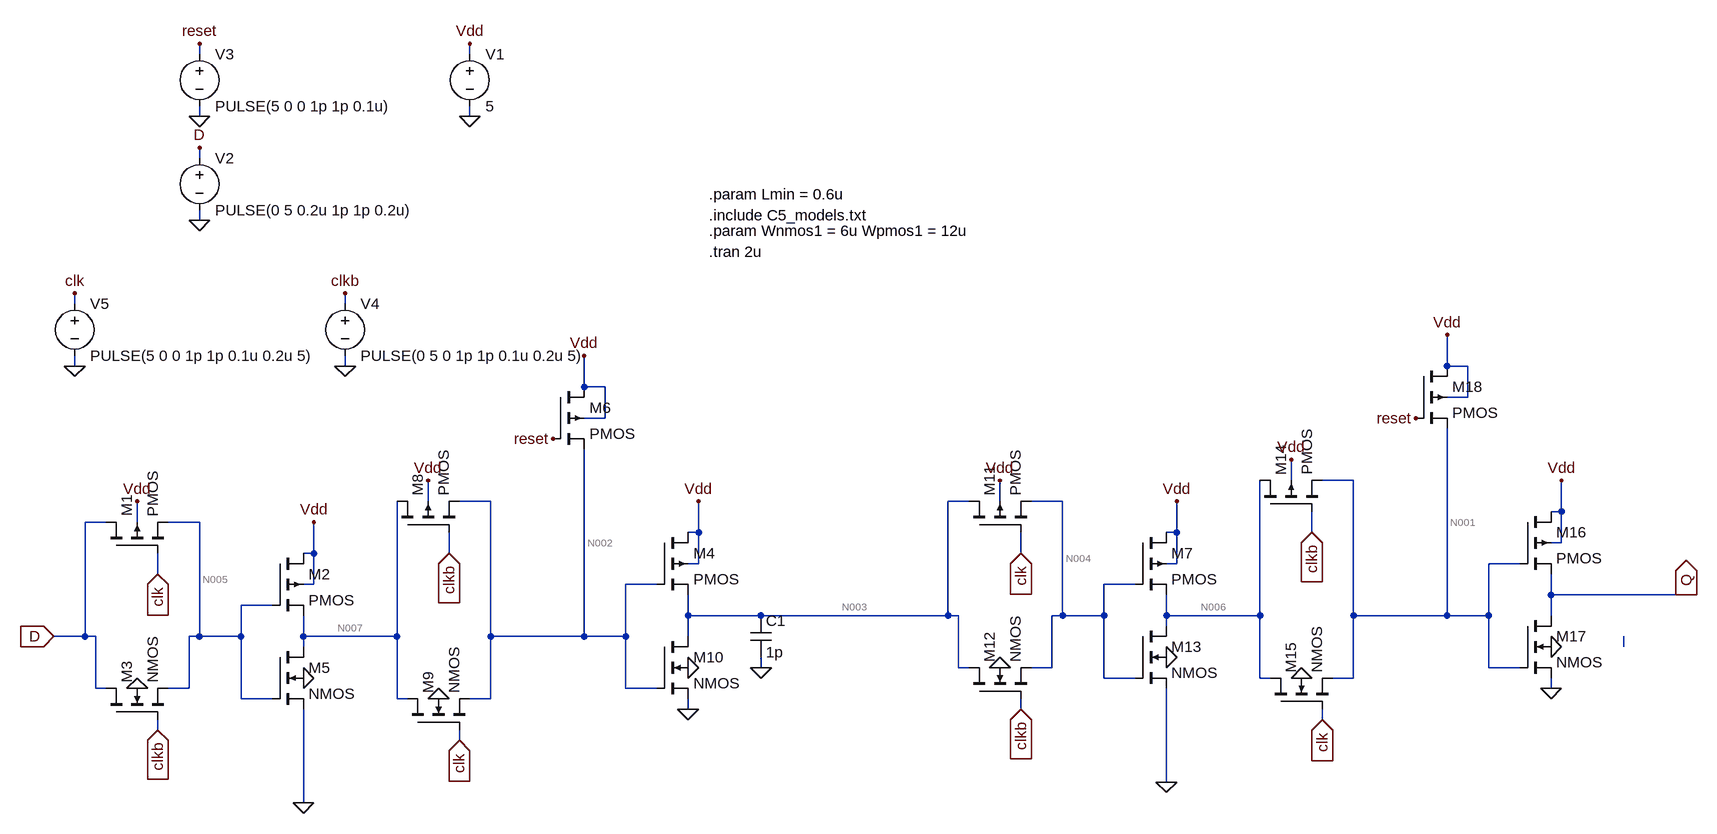
[diagram p0: schematic shiftx.asc]
shiftx.asc, the LTspice schematic file:
Version 4
SHEET 1 1732 852
WIRE -624 -512 -624 -528
WIRE -208 -512 -208 -528
WIRE -624 -416 -624 -432
WIRE -208 -416 -208 -432
WIRE -624 -352 -624 -368
WIRE -624 -256 -624 -272
WIRE -816 -128 -816 -144
WIRE -400 -128 -400 -144
WIRE -816 -32 -816 -48
WIRE -400 -32 -400 -48
WIRE 1296 -32 1296 -80
WIRE 1328 -32 1296 -32
WIRE -32 0 -32 -48
WIRE 0 0 -32 0
WIRE 1328 16 1328 -32
WIRE 1328 16 1296 16
WIRE 0 48 0 0
WIRE 0 48 -32 48
WIRE 1056 144 1056 112
WIRE 1152 144 1104 144
WIRE -272 176 -272 144
WIRE -176 176 -224 176
WIRE 560 176 528 176
WIRE 608 176 608 144
WIRE 704 176 656 176
WIRE 1472 192 1472 144
WIRE 1472 192 1456 192
WIRE -768 208 -800 208
WIRE -720 208 -720 176
WIRE -624 208 -672 208
WIRE 144 224 144 176
WIRE 144 224 128 224
WIRE 880 224 880 176
WIRE 880 224 864 224
WIRE 1088 224 1088 192
WIRE 1472 240 1472 192
WIRE 1472 240 1456 240
WIRE -448 256 -448 208
WIRE -448 256 -464 256
WIRE -240 256 -240 224
WIRE 640 256 640 224
WIRE 144 272 144 224
WIRE 144 272 128 272
WIRE 880 272 880 224
WIRE 880 272 864 272
WIRE 1408 272 1360 272
WIRE -688 288 -688 256
WIRE -448 304 -448 256
WIRE -448 304 -464 304
WIRE 80 304 32 304
WIRE 816 304 768 304
WIRE 1456 320 1456 288
WIRE 1664 320 1456 320
WIRE 1680 320 1664 320
WIRE -512 336 -560 336
WIRE 128 352 128 320
WIRE 240 352 128 352
WIRE 528 352 528 176
WIRE 528 352 240 352
WIRE 544 352 528 352
WIRE 704 352 704 176
WIRE 704 352 688 352
WIRE 768 352 768 304
WIRE 768 352 704 352
WIRE 864 352 864 320
WIRE 1008 352 1008 144
WIRE 1008 352 864 352
WIRE 1152 352 1152 144
WIRE 1296 352 1296 64
WIRE 1296 352 1152 352
WIRE 1360 352 1360 272
WIRE 1360 352 1296 352
WIRE 1456 352 1456 320
WIRE 864 368 864 352
WIRE -800 384 -800 208
WIRE -800 384 -848 384
WIRE -784 384 -800 384
WIRE -624 384 -624 208
WIRE -624 384 -640 384
WIRE -560 384 -560 336
WIRE -560 384 -624 384
WIRE -464 384 -464 352
WIRE -320 384 -320 176
WIRE -320 384 -464 384
WIRE -176 384 -176 176
WIRE -32 384 -32 96
WIRE -32 384 -176 384
WIRE 32 384 32 304
WIRE 32 384 -32 384
WIRE 128 384 128 352
WIRE -464 400 -464 384
WIRE 1568 400 1568 384
WIRE 240 432 240 416
WIRE 544 432 544 352
WIRE 560 432 544 432
WIRE 688 432 688 352
WIRE 688 432 656 432
WIRE 1360 432 1360 352
WIRE 1408 432 1360 432
WIRE 768 448 768 352
WIRE 816 448 768 448
WIRE 1008 448 1008 352
WIRE 1024 448 1008 448
WIRE 1152 448 1152 352
WIRE 1152 448 1120 448
WIRE -784 464 -784 384
WIRE -768 464 -784 464
WIRE -640 464 -640 384
WIRE -640 464 -672 464
WIRE 32 464 32 384
WIRE 80 464 32 464
WIRE 1456 464 1456 448
WIRE -560 480 -560 384
WIRE -512 480 -560 480
WIRE -320 480 -320 384
WIRE -304 480 -320 480
WIRE -176 480 -176 384
WIRE -176 480 -208 480
WIRE 128 496 128 480
WIRE 640 496 640 480
WIRE 1104 512 1104 496
WIRE -688 528 -688 512
WIRE -224 544 -224 528
WIRE 864 608 864 464
WIRE -464 640 -464 496
FLAG -448 208 Vdd
FLAG -208 -416 0
FLAG -208 -528 Vdd
FLAG -720 464 0
FLAG -720 176 Vdd
FLAG -848 384 D
IOPIN -848 384 In
FLAG -688 288 clk
IOPIN -688 288 In
FLAG -688 528 clkb
IOPIN -688 528 In
FLAG -464 448 0
FLAG -464 640 0
FLAG -256 480 0
FLAG -272 144 Vdd
FLAG -240 256 clkb
IOPIN -240 256 In
FLAG -224 544 clk
IOPIN -224 544 In
FLAG 144 176 Vdd
FLAG 128 432 0
FLAG 128 496 0
FLAG -32 -48 Vdd
FLAG -624 -256 0
FLAG -624 -368 D
FLAG -624 -416 0
FLAG -624 -528 reset
FLAG -80 80 reset
FLAG -400 -32 0
FLAG -400 -144 clkb
FLAG -816 -32 0
FLAG -816 -144 clk
FLAG 240 432 0
FLAG 880 176 Vdd
FLAG 608 432 0
FLAG 608 144 Vdd
FLAG 640 256 clk
IOPIN 640 256 In
FLAG 640 496 clkb
IOPIN 640 496 In
FLAG 864 416 0
FLAG 864 608 0
FLAG 1072 448 0
FLAG 1056 112 Vdd
FLAG 1088 224 clkb
IOPIN 1088 224 In
FLAG 1104 512 clk
IOPIN 1104 512 In
FLAG 1472 144 Vdd
FLAG 1456 400 0
FLAG 1456 464 0
FLAG 1664 320 Q
IOPIN 1664 320 Out
FLAG 1296 -80 Vdd
FLAG 1248 48 reset
SYMBOL pmos4 -512 256 R0
SYMATTR InstName M2
SYMATTR Value2 l='Lmin' w='Wpmos1' ad='Lmin*Wpmos1' as='Lmin*Wpmos1' pd='2*(Lmin+Wpmos1)' ps='2*(Lmin+Wpmos1)' m=1
SYMBOL pmos4 -768 256 R270
SYMATTR InstName M1
SYMATTR Value2 l='Lmin' w=12u ad='Lmin*Wpmos1' as='Lmin*Wpmos1' pd='2*(Lmin+Wpmos1)' ps='2*(Lmin+Wpmos1)' m=1
SYMBOL nmos4 -768 512 R270
SYMATTR InstName M3
SYMATTR Value2 l='Lmin' w=6u ad='Lmin*Wnmos1' as='Lmin*Wnmos1' pd='2*(Lmin+Wnmos1)' ps='2*(Lmin+Wnmos1)' m=1
SYMBOL nmos4 -512 400 R0
SYMATTR InstName M5
SYMATTR Value2 l='Lmin' w='Wnmos1' ad='Lmin*Wnmos1' as='Lmin*Wnmos1' pd='2*(Lmin+Wnmos1)' ps='2*(Lmin+Wnmos1)' m=1
SYMBOL voltage -208 -528 R0
SYMATTR InstName V1
SYMATTR Value 5
SYMBOL pmos4 -320 224 R270
SYMATTR InstName M8
SYMATTR Value2 l='Lmin' w=12u ad='Lmin*Wpmos1' as='Lmin*Wpmos1' pd='2*(Lmin+Wpmos1)' ps='2*(Lmin+Wpmos1)' m=1
SYMBOL nmos4 -304 528 R270
SYMATTR InstName M9
SYMATTR Value2 l='Lmin' w=6u ad='Lmin*Wnmos1' as='Lmin*Wnmos1' pd='2*(Lmin+Wnmos1)' ps='2*(Lmin+Wnmos1)' m=1
SYMBOL pmos4 80 224 R0
SYMATTR InstName M4
SYMATTR Value2 l='Lmin' w=24u ad='Lmin*Wpmos1' as='Lmin*Wpmos1' pd='2*(Lmin+Wpmos1)' ps='2*(Lmin+Wpmos1)' m=1
SYMBOL nmos4 80 384 R0
SYMATTR InstName M10
SYMATTR Value2 l='Lmin' w=12u ad='Lmin*Wnmos1' as='Lmin*Wnmos1' pd='2*(Lmin+Wnmos1)' ps='2*(Lmin+Wnmos1)' m=1
SYMBOL pmos4 -80 0 R0
SYMATTR InstName M6
SYMATTR Value2 l='Lmin' w=3u ad='Lmin*Wpmos1' as='Lmin*Wpmos1' pd='2*(Lmin+Wpmos1)' ps='2*(Lmin+Wpmos1)' m=1
SYMBOL voltage -624 -368 R0
WINDOW 123 0 0 Left 0
WINDOW 39 0 0 Left 0
SYMATTR InstName V2
SYMATTR Value PULSE(0 5 0.2u 1p 1p 0.2u)
SYMBOL voltage -624 -528 R0
WINDOW 123 0 0 Left 0
WINDOW 39 0 0 Left 0
SYMATTR InstName V3
SYMATTR Value PULSE(5 0 0 1p 1p 0.1u)
SYMBOL voltage -400 -144 R0
WINDOW 123 0 0 Left 0
WINDOW 39 0 0 Left 0
SYMATTR InstName V4
SYMATTR Value PULSE(0 5 0 1p 1p 0.1u 0.2u 5)
SYMBOL voltage -816 -144 R0
WINDOW 123 0 0 Left 0
WINDOW 39 0 0 Left 0
SYMATTR InstName V5
SYMATTR Value PULSE(5 0 0 1p 1p 0.1u 0.2u 5)
SYMBOL cap 224 352 R0
SYMATTR InstName C1
SYMATTR Value 1p
SYMBOL pmos4 816 224 R0
SYMATTR InstName M7
SYMATTR Value2 l='Lmin' w='Wpmos1' ad='Lmin*Wpmos1' as='Lmin*Wpmos1' pd='2*(Lmin+Wpmos1)' ps='2*(Lmin+Wpmos1)' m=1
SYMBOL pmos4 560 224 R270
SYMATTR InstName M11
SYMATTR Value2 l='Lmin' w=12u ad='Lmin*Wpmos1' as='Lmin*Wpmos1' pd='2*(Lmin+Wpmos1)' ps='2*(Lmin+Wpmos1)' m=1
SYMBOL nmos4 560 480 R270
SYMATTR InstName M12
SYMATTR Value2 l='Lmin' w=6u ad='Lmin*Wnmos1' as='Lmin*Wnmos1' pd='2*(Lmin+Wnmos1)' ps='2*(Lmin+Wnmos1)' m=1
SYMBOL nmos4 816 368 R0
SYMATTR InstName M13
SYMATTR Value2 l='Lmin' w='Wnmos1' ad='Lmin*Wnmos1' as='Lmin*Wnmos1' pd='2*(Lmin+Wnmos1)' ps='2*(Lmin+Wnmos1)' m=1
SYMBOL pmos4 1008 192 R270
SYMATTR InstName M14
SYMATTR Value2 l='Lmin' w=12u ad='Lmin*Wpmos1' as='Lmin*Wpmos1' pd='2*(Lmin+Wpmos1)' ps='2*(Lmin+Wpmos1)' m=1
SYMBOL nmos4 1024 496 R270
SYMATTR InstName M15
SYMATTR Value2 l='Lmin' w=6u ad='Lmin*Wnmos1' as='Lmin*Wnmos1' pd='2*(Lmin+Wnmos1)' ps='2*(Lmin+Wnmos1)' m=1
SYMBOL pmos4 1408 192 R0
SYMATTR InstName M16
SYMATTR Value2 l='Lmin' w=24u ad='Lmin*Wpmos1' as='Lmin*Wpmos1' pd='2*(Lmin+Wpmos1)' ps='2*(Lmin+Wpmos1)' m=1
SYMBOL nmos4 1408 352 R0
SYMATTR InstName M17
SYMATTR Value2 l='Lmin' w=12u ad='Lmin*Wnmos1' as='Lmin*Wnmos1' pd='2*(Lmin+Wnmos1)' ps='2*(Lmin+Wnmos1)' m=1
SYMBOL pmos4 1248 -32 R0
SYMATTR InstName M18
SYMATTR Value2 l='Lmin' w=3u ad='Lmin*Wpmos1' as='Lmin*Wpmos1' pd='2*(Lmin+Wpmos1)' ps='2*(Lmin+Wpmos1)' m=1
TEXT 160 -264 Left 2 !.include C5_models.txt
TEXT 160 -296 Left 2 !.param Lmin = 0.6u
TEXT 160 -240 Left 2 !.param Wnmos1 = 6u Wpmos1 = 12u
TEXT 160 -208 Left 2 !.tran 2u

The netlist it stands for:
* shiftx.asc
M2 Vdd N005 N007 Vdd PMOS l='Lmin' w='Wpmos1' ad='Lmin*Wpmos1' as='Lmin*Wpmos1' pd='2*(Lmin+Wpmos1)' ps='2*(Lmin+Wpmos1)' m=1
M1 D clk N005 Vdd PMOS l='Lmin' w=12u ad='Lmin*Wpmos1' as='Lmin*Wpmos1' pd='2*(Lmin+Wpmos1)' ps='2*(Lmin+Wpmos1)' m=1
M3 D clkb N005 0 NMOS l='Lmin' w=6u ad='Lmin*Wnmos1' as='Lmin*Wnmos1' pd='2*(Lmin+Wnmos1)' ps='2*(Lmin+Wnmos1)' m=1
M5 N007 N005 0 0 NMOS l='Lmin' w='Wnmos1' ad='Lmin*Wnmos1' as='Lmin*Wnmos1' pd='2*(Lmin+Wnmos1)' ps='2*(Lmin+Wnmos1)' m=1
V1 Vdd 0 5
M8 N007 clkb N002 Vdd PMOS l='Lmin' w=12u ad='Lmin*Wpmos1' as='Lmin*Wpmos1' pd='2*(Lmin+Wpmos1)' ps='2*(Lmin+Wpmos1)' m=1
M9 N007 clk N002 0 NMOS l='Lmin' w=6u ad='Lmin*Wnmos1' as='Lmin*Wnmos1' pd='2*(Lmin+Wnmos1)' ps='2*(Lmin+Wnmos1)' m=1
M4 Vdd N002 N003 Vdd PMOS l='Lmin' w=24u ad='Lmin*Wpmos1' as='Lmin*Wpmos1' pd='2*(Lmin+Wpmos1)' ps='2*(Lmin+Wpmos1)' m=1
M10 N003 N002 0 0 NMOS l='Lmin' w=12u ad='Lmin*Wnmos1' as='Lmin*Wnmos1' pd='2*(Lmin+Wnmos1)' ps='2*(Lmin+Wnmos1)' m=1
M6 Vdd reset N002 Vdd PMOS l='Lmin' w=3u ad='Lmin*Wpmos1' as='Lmin*Wpmos1' pd='2*(Lmin+Wpmos1)' ps='2*(Lmin+Wpmos1)' m=1
V2 D 0 PULSE(0 5 0.2u 1p 1p 0.2u)
V3 reset 0 PULSE(5 0 0 1p 1p 0.1u)
V4 clkb 0 PULSE(0 5 0 1p 1p 0.1u 0.2u 5)
V5 clk 0 PULSE(5 0 0 1p 1p 0.1u 0.2u 5)
C1 N003 0 1p
M7 Vdd N004 N006 Vdd PMOS l='Lmin' w='Wpmos1' ad='Lmin*Wpmos1' as='Lmin*Wpmos1' pd='2*(Lmin+Wpmos1)' ps='2*(Lmin+Wpmos1)' m=1
M11 N003 clk N004 Vdd PMOS l='Lmin' w=12u ad='Lmin*Wpmos1' as='Lmin*Wpmos1' pd='2*(Lmin+Wpmos1)' ps='2*(Lmin+Wpmos1)' m=1
M12 N003 clkb N004 0 NMOS l='Lmin' w=6u ad='Lmin*Wnmos1' as='Lmin*Wnmos1' pd='2*(Lmin+Wnmos1)' ps='2*(Lmin+Wnmos1)' m=1
M13 N006 N004 0 0 NMOS l='Lmin' w='Wnmos1' ad='Lmin*Wnmos1' as='Lmin*Wnmos1' pd='2*(Lmin+Wnmos1)' ps='2*(Lmin+Wnmos1)' m=1
M14 N006 clkb N001 Vdd PMOS l='Lmin' w=12u ad='Lmin*Wpmos1' as='Lmin*Wpmos1' pd='2*(Lmin+Wpmos1)' ps='2*(Lmin+Wpmos1)' m=1
M15 N006 clk N001 0 NMOS l='Lmin' w=6u ad='Lmin*Wnmos1' as='Lmin*Wnmos1' pd='2*(Lmin+Wnmos1)' ps='2*(Lmin+Wnmos1)' m=1
M16 Vdd N001 Q Vdd PMOS l='Lmin' w=24u ad='Lmin*Wpmos1' as='Lmin*Wpmos1' pd='2*(Lmin+Wpmos1)' ps='2*(Lmin+Wpmos1)' m=1
M17 Q N001 0 0 NMOS l='Lmin' w=12u ad='Lmin*Wnmos1' as='Lmin*Wnmos1' pd='2*(Lmin+Wnmos1)' ps='2*(Lmin+Wnmos1)' m=1
M18 Vdd reset N001 Vdd PMOS l='Lmin' w=3u ad='Lmin*Wpmos1' as='Lmin*Wpmos1' pd='2*(Lmin+Wpmos1)' ps='2*(Lmin+Wpmos1)' m=1
.model NMOS NMOS
.model PMOS PMOS
.lib standard.mos
.include C5_models.txt
.param Lmin = 0.6u
.param Wnmos1 = 6u Wpmos1 = 12u
.tran 2u
.backanno
.end

* Results of the author's LTspice run, read from the files saved beside the schematic
* Operating Point, zero values left out:
*   V(vdd) = 5 V
*   V(n005) = 2.487 V
*   V(n007) = 1.26 V
*   V(clk) = 5 V
*   V(n002) = 1.26 V
*   V(n003) = 4.806 V
*   V(reset) = 5 V
*   V(n004) = 2.5 V
*   V(n006) = 1.161 V
*   V(n001) = 1.161 V
*   V(q) = 4.851 V
*   Id(M17) = 390.1 µA
*   Ib(M17) = -4.851 pA
*   Is(M17) = -390.1 µA
*   Id(M15) = -5.357 pA
*   Ib(M15) = -2.323 pA
*   Is(M15) = 7.68 pA
*   Id(M13) = 832.8 µA
*   Ib(M13) = -1.161 pA
*   Is(M13) = -832.8 µA
*   Id(M12) = 4.806 pA
*   Ib(M12) = -7.306 pA
*   Is(M12) = 2.501 pA
*   Id(M10) = 494.7 µA
*   Ib(M10) = -4.806 pA
*   Is(M10) = -494.7 µA
*   Id(M9) = -4.96 pA
*   Ib(M9) = -2.52 pA
*   Is(M9) = 7.481 pA
*   Id(M5) = 839 µA
*   Ib(M5) = -1.26 pA
*   Is(M5) = -839 µA
*   Ib(M3) = -2.487 pA
*   Is(M3) = 2.514 pA
*   Ib(M18) = 3.84 pA
*   Is(M18) = -3.84 pA
*   Id(M16) = 390.1 µA
*   Is(M16) = -390.1 µA
*   Id(M14) = -3.84 pA
*   Ib(M14) = 7.68 pA
*   Is(M14) = -3.84 pA
*   Ib(M11) = 2.696 pA
*   Is(M11) = -2.501 pA
*   Id(M7) = 832.8 µA
*   Ib(M7) = 3.84 pA
*   Is(M7) = -832.8 µA
*   Ib(M6) = 3.741 pA
*   Is(M6) = -3.741 pA
*   Id(M4) = 494.7 µA
*   Is(M4) = -494.7 µA
*   Id(M8) = -3.743 pA
*   Ib(M8) = 7.482 pA
*   Is(M8) = -3.739 pA
*   Id(M1) = -5.001 pA
*   Ib(M1) = 7.515 pA
*   Is(M1) = -2.514 pA
*   Id(M2) = 839 µA
*   Ib(M2) = 3.741 pA
*   Is(M2) = -839 µA
*   I(V2) = 5.027 pA
*   I(V1) = -2.557 mA
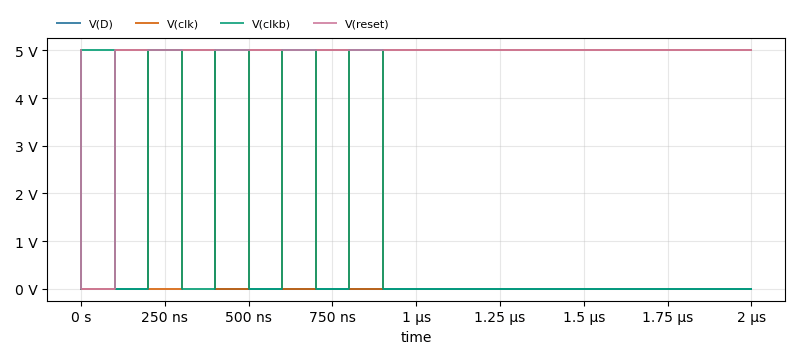
[diagram p1: Transient Analysis of shiftx.asc, plotted from the saved traces]
* Transient Analysis, 1 run:
*   V(D): min 0 V, max 5 V, average 500 mV, rms 1.581 V, last 0 V
*   V(clk): min 0 V, max 5 V, average 3.75 V, rms 4.33 V, last 5 V
*   V(clkb): min 0 V, max 5 V, average 1.25 V, rms 2.5 V, last 0 V
*   V(reset): min 0 V, max 5 V, average 4.75 V, rms 4.873 V, last 5 V